# Altium schematic sheet SAM4S_Piezo_LED.SchDoc: Wacky Hat Schematic
size A3; DrawnBy: A. Finlayson, H. Pollard; Organization: Group 17; Address1: ECE Department; Address2: University of Canterbury; Address3: Christchurch 8041; Address4: New Zealand; Revision: 1; SheetNumber: 3; SheetTotal: 3
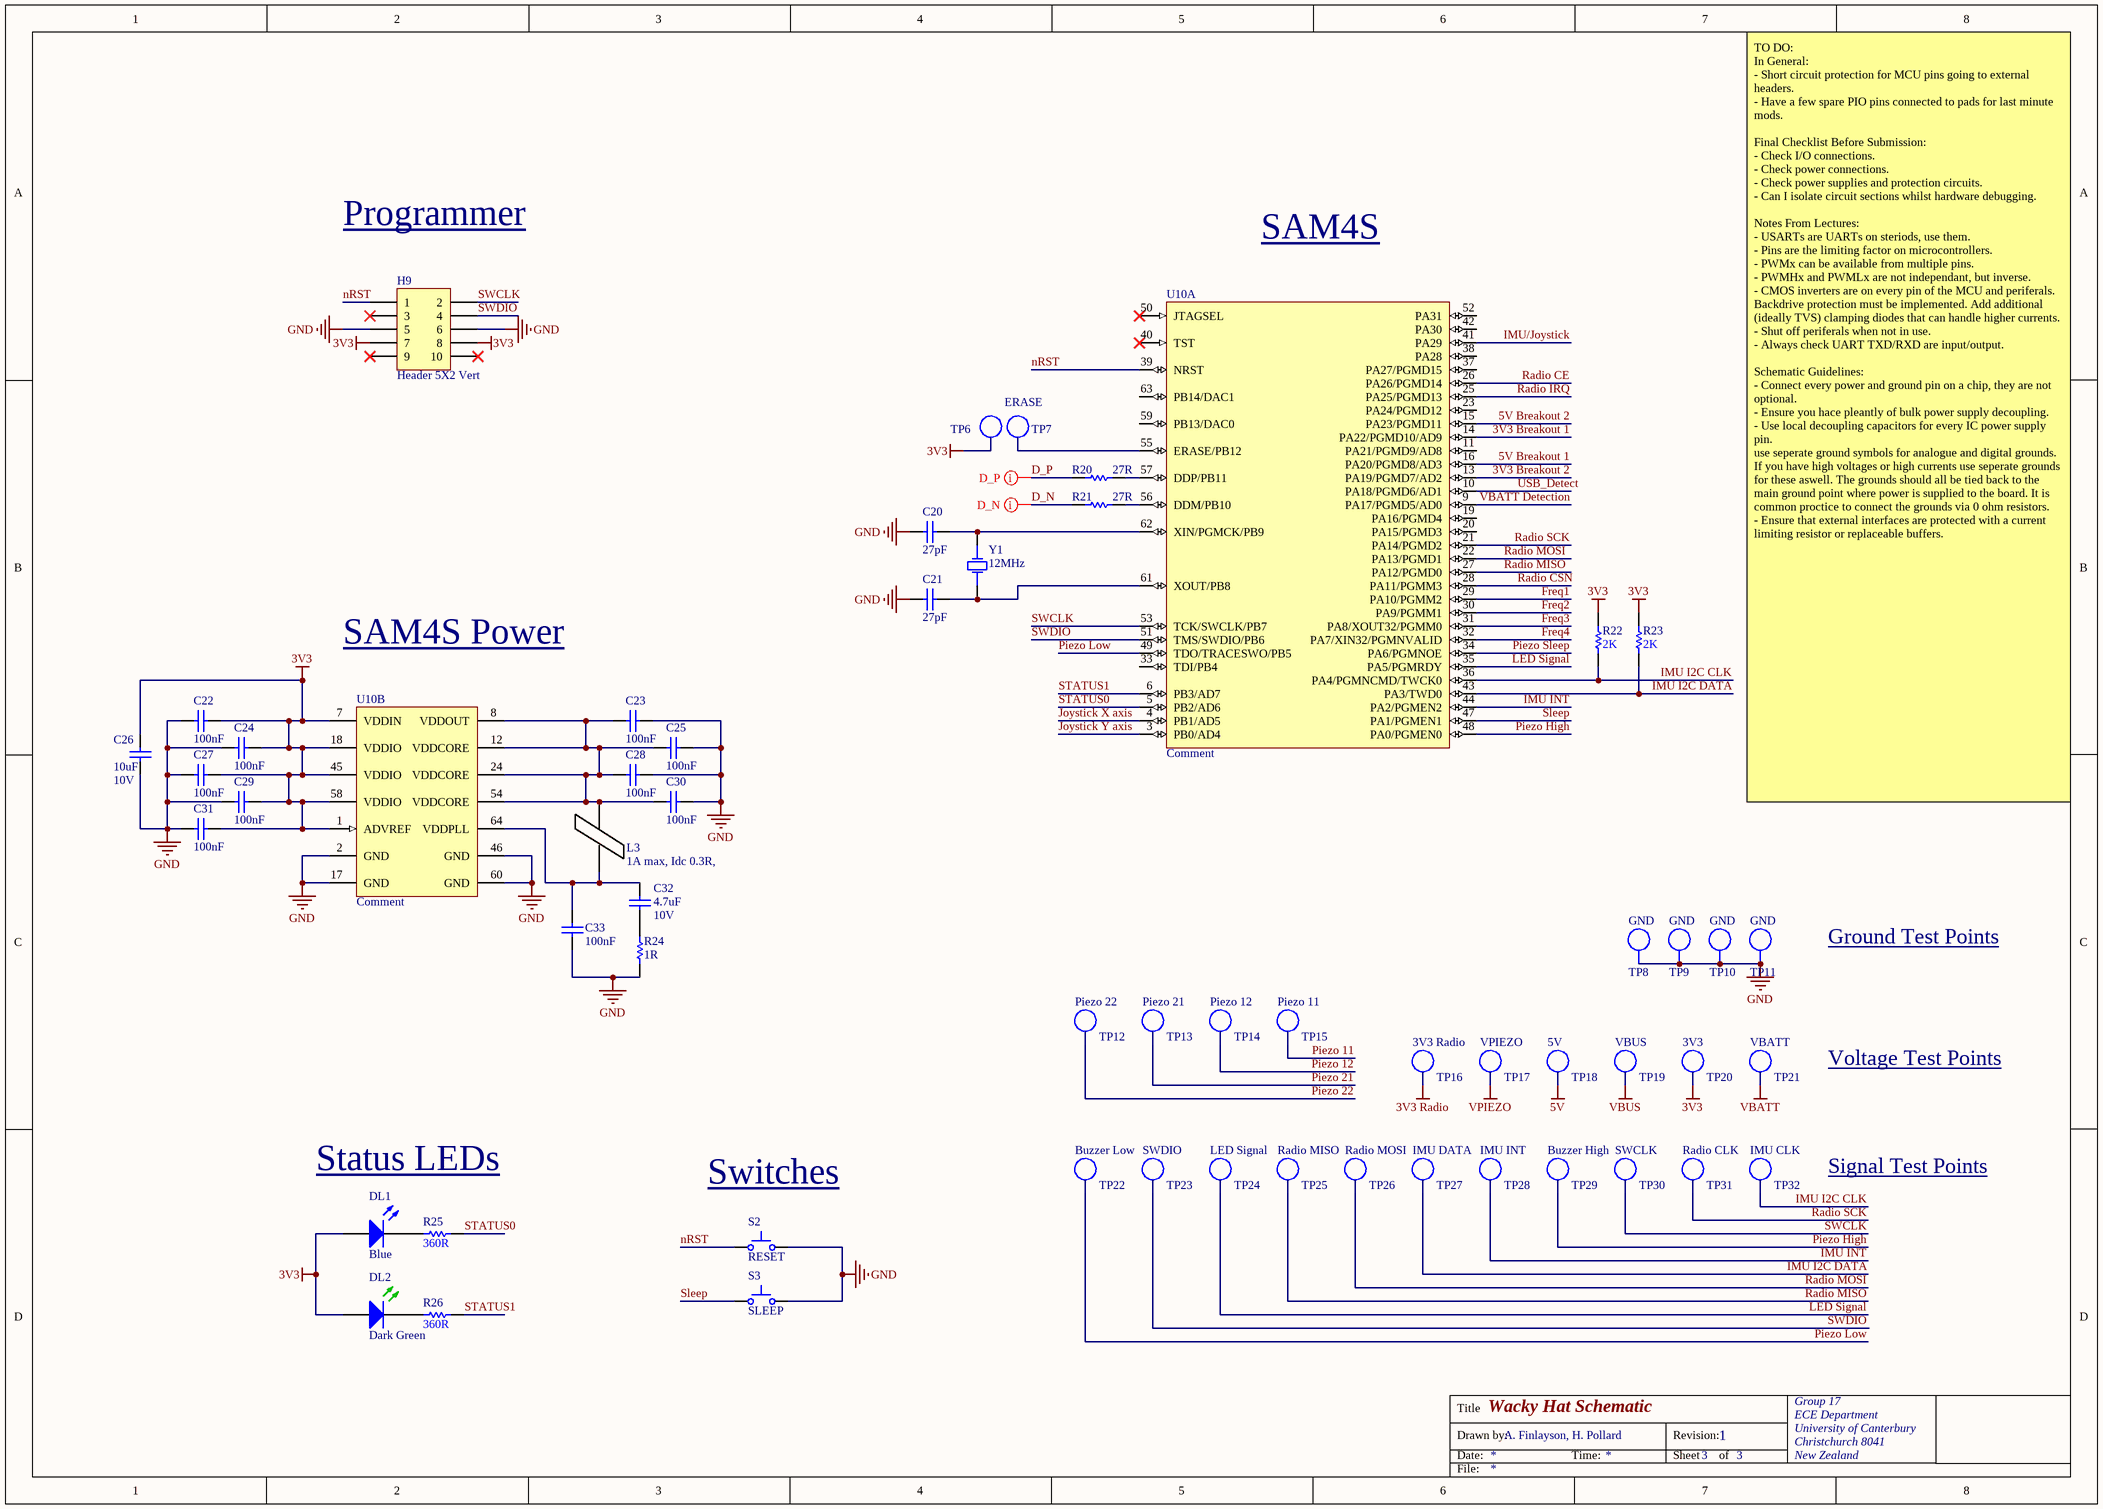
[diagram p0: SAM4S_Piezo_LED.SchDoc]

## Parts
C20  27pF  [CAPC1608L]
C21  27pF  [CAPC1608L]
C22  100nF  [CAPC1608L]
C23  100nF  [CAPC1608L]
C24  100nF  [CAPC1608L]
C25  100nF  [CAPC1608L]
C26  Max Voltage: 10V  [CAPC2012L]  (hidden comment: 10uF)
C27  100nF  [CAPC1608L]
C28  100nF  [CAPC1608L]
C29  100nF  [CAPC1608L]
C30  100nF  [CAPC1608L]
C31  100nF  [CAPC1608L]
C32  Max Voltage: 10V  [CAPC1608N]  (hidden comment: 4.7uF)
C33  100nF  [CAPC1608L]
DL1  Blue  [WL-SMCW0603]
DL2  Dark Green  [WL-SMCW0603]
H9  Header 5X2 Vert  [IDC2.54-V10D]
L3  1A max, Idc 0.3R,  [INDC3216L]
R20  27R  [RESC1608L]
R21  27R  [RESC1608L]
R22  2K  [RESC1608L]
R23  2K  [RESC1608L]
R24  1R  [RESC3216L]
R25  360R  [RESC1608L]
R26  360R  [RESC1608L]
S2  RESET  [EVQPNF05M]
S3  SLEEP  [EVQPNF05M]
TP6  TP_0603  [TP_0603]  (value not drawn)
TP7  ERASE  [TP_0603]
TP8  GND  [TP_1206]  (no BOM)
TP9  GND  [TP_1206]  (no BOM)
TP10  GND  [TP_1206]  (no BOM)
TP11  GND  [TP_1206]  (no BOM)
TP12  Piezo 22  [TP_0603]
TP13  Piezo 21  [TP_0603]
TP14  Piezo 12  [TP_0603]
TP15  Piezo 11  [TP_0603]
TP16  3V3 Radio  [TP_0603]
TP17  VPIEZO  [TP_0603]
TP18  5V  [TP_0603]
TP19  VBUS  [TP_0603]
TP20  3V3  [TP_0603]
TP21  VBATT  [TP_0603]
TP22  Buzzer Low  [TP_0603]
TP23  SWDIO  [TP_0603]
TP24  LED Signal  [TP_0603]
TP25  Radio MISO  [TP_0603]
TP26  Radio MOSI  [TP_0603]
TP27  IMU DATA  [TP_0603]
TP28  IMU INT  [TP_0603]
TP29  Buzzer High  [TP_0603]
TP30  SWCLK  [TP_0603]
TP31  Radio CLK  [TP_0603]
TP32  IMU CLK  [TP_0603]
U10  Comment  [LQFP64_L]  (parts A,B of 2)
Y1  12MHz  [6.0X3.5-4]

## Nets
3V3: C22.2 C24.2 C26.2 C27.2 C29.2 C31.2 DL1.2(A) DL2.2(A) H9.7 H9.8 R22.2 R23.2 TP6.1(TP) TP20.1(TP) U10.1(ADVREF) U10.7(VDDIN) U10.18(VDDIO) U10.45(VDDIO) U10.58(VDDIO)
3V3 Radio: TP16.1(TP)
5V: TP18.1(TP)
GND: C20.1 C21.1 C22.1 C23.2 C24.1 C25.2 C26.1 C27.1 C28.2 C29.1 C30.2 C31.1 C33.1 H9.5 H9.6 R24.1 S2.2 S3.2 TP8.1 TP9.1 TP10.1 TP11.1 U10.2(GND) U10.17(GND) U10.46(GND) U10.60(GND)
VBATT: TP21.1(TP)
VBUS: TP19.1(TP)
VPIEZO: TP17.1(TP)
3V3 Breakout 1: U10.14(PA22/PGMD10/AD9)
3V3 Breakout 2: U10.13(PA19/PGMD7/AD2)
5V Breakout 1: U10.16(PA20/PGMD8/AD3)
5V Breakout 2: U10.15(PA23/PGMD11)
D_N: R21.1
D_P: R20.1
Freq1: U10.29(PA10/PGMM2)
Freq2: U10.30(PA9/PGMM1)
Freq3: U10.31(PA8/XOUT32/PGMM0)
Freq4: U10.32(PA7/XIN32/PGMNVALID)
IMU I2C CLK: R22.1 TP32.1(TP) U10.36(PA4/PGMNCMD/TWCK0)
IMU I2C DATA: R23.1 TP27.1(TP) U10.43(PA3/TWD0)
IMU INT: TP28.1(TP) U10.44(PA2/PGMEN2)
IMU/Joystick: U10.41(PA29)
Joystick X axis: U10.4(PB1/AD5)
Joystick Y axis: U10.3(PB0/AD4)
LED Signal: TP24.1(TP) U10.35(PA5/PGMRDY)
nRST: H9.1 S2.1 U10.39(NRST)
Piezo 11: TP15.1(TP)
Piezo 12: TP14.1(TP)
Piezo 21: TP13.1(TP)
Piezo 22: TP12.1(TP)
Piezo High: TP29.1(TP) U10.48(PA0/PGMEN0)
Piezo Low: TP22.1(TP) U10.49(TDO/TRACESWO/PB5)
Piezo Sleep: U10.34(PA6/PGMNOE)
Radio CE: U10.26(PA26/PGMD14)
Radio CSN: U10.28(PA11/PGMM3)
Radio IRQ: U10.25(PA25/PGMD13)
Radio MISO: TP25.1(TP) U10.27(PA12/PGMD0)
Radio MOSI: TP26.1(TP) U10.22(PA13/PGMD1)
Radio SCK: TP31.1(TP) U10.21(PA14/PGMD2)
Sleep: S3.1 U10.47(PA1/PGMEN1)
STATUS0: R25.2 U10.5(PB2/AD6)
STATUS1: R26.2 U10.6(PB3/AD7)
SWCLK: H9.2 TP30.1(TP) U10.53(TCK/SWCLK/PB7)
SWDIO: H9.4 TP23.1(TP) U10.51(TMS/SWDIO/PB6)
USB_Detect: U10.10(PA18/PGMD6/AD1)
VBATT Detection: U10.9(PA17/PGMD5/AD0)
NetC20_2: C20.2 U10.62(XIN/PGMCK/PB9) Y1.3(OSC2)
NetC21_2: C21.2 U10.61(XOUT/PB8) Y1.1(OSC1)
NetC23_1: C23.1 C25.1 C28.1 C30.1 L3.2 U10.8(VDDOUT) U10.12(VDDCORE) U10.24(VDDCORE) U10.54(VDDCORE)
NetC32_1: C32.1 R24.2
NetC32_2: C32.2 C33.2 L3.1 U10.64(VDDPLL)
NetDL1_1: DL1.1(K) R25.1
NetDL2_1: DL2.1(K) R26.1
NetR20_2: R20.2 U10.57(DDP/PB11)
NetR21_2: R21.2 U10.56(DDM/PB10)
NetTP7_1: TP7.1(TP) U10.55(ERASE/PB12)

Not connected (* = marked no-connect by the designer): H9 3* 9* 10*; U10 11(PA21/PGMD9/AD8) 19(PA16/PGMD4) 20(PA15/PGMD3) 23(PA24/PGMD12) 33(TDI/PB4) 37(PA27/PGMD15) 38(PA28) 40(TST)* 42(PA30) 50(JTAGSEL)* 52(PA31) 59(PB13/DAC0) 63(PB14/DAC1)

## Layout directives
differential pair: D_N, D_P

## Notes on the sheet
- Programmer
- SAM4S
- SAM4S Power
- TO DO:
  In General:
  - Short circuit protection for MCU pins going to external headers.
  - Have a few spare PIO pins connected to pads for last minute mods.
  Final Checklist Before Submission:
  - Check I/O connections.
  - Check power connections.
  - Check power supplies and protection circuits.
  - Can I isolate circuit sections whilst hardware debugging.
  Notes From Lectures:
  - USARTs are UARTs on steriods, use them.
  - Pins are the limiting factor on microcontrollers.
  - PWMx can be available from multiple pins.
  - PWMHx and PWMLx are not independant, but inverse.
  - CMOS inverters are on every pin of the MCU and periferals. Backdrive protection must be implemented. Add additional (ideally TVS) clamping diodes that can handle higher currents.
  - Shut off periferals when not in use.
  - Always check UART TXD/RXD are input/output.
  Schematic Guidelines:
  - Connect every power and ground pin on a chip, they are not optional.
  - Ensure you hace pleantly of bulk power supply decoupling.
  - Use local decoupling capacitors for every IC power supply pin.
  use seperate ground symbols for analogue and digital grounds. If you have high voltages or high currents use seperate grounds for these aswell. The grounds should all be tied back to the main ground point where power is supplied to the board. It is common proctice to connect the grounds via 0 ohm resistors.
  - Ensure that external interfaces are protected with a current limiting resistor or replaceable buffers.
- Ground Test Points
- Voltage Test Points
- Status LEDs
- Switches
- Signal Test Points
- Title
- Drawn by:
- Date:
- Time:
- Revision:
- Sheet
- of
- File:

## Library data of the parts
C20 C21 = CC_27pF_0603: CAP CER 27pF NPO/COG +-5% 50V 0603; PackageReference: 0603; Code_IPC: 1608 [0603]; Verify: *; Supplier: ECE Dept; Storage Location: PCB Assembly WS; Value: 27pF
C22-C25 C27-C31 C33 = CC_100nF_0603: CAP CER 100nF X7R +-10% 50V 0603; PackageReference: 0603; Code_IPC: 1608 [0603]; Verify: *; Supplier: ECE Dept; Storage Location: PCB Assembly WS; Value: 100nF
C26 = CC_10uF_0805_10V: CAP CER 10uF X7R +-20% 10V 0805; Note: Footprint corresponds to dimensions for bulk cassette packaging. This case size has tightened tolerances.; PackageReference: 0805; Code_IPC: 2012[0805]; Verify: *; Supplier: ECE Dept; Storage Location: PCB Assembly WS; Value: 10uF
C32 = CC_4.7uF_0603: CAP CER 4.7uF X5R +-20%  10V 0603; Note: Footprint corresponds to dimensions for bulk cassette packaging. This case size has tightened tolerances.; PackageReference: 0805; Code_IPC: 2012[0805]; Verify: *; Supplier: ECE Dept; Storage Location: PCB Assembly WS; Value: 4.7uF
DL1 = DL_150060BS75000: LED Blue 270mcd 0603 SMD; Manufacturer: WURTH ELEKTRONIK; Forward Current If: 30; Forward Voltage: 3.2; Luminous Intensity: 270; Viewing Angle: 120°; Wavelength Typ: 470; Pricing: 1=0.3844, 50=0.3252, 100=0.2957, 500=0.2365 (NZD); Supplier 1: Farnell; Supplier Part Number 1: 2322069; Manufacturer Part Number: 150060BS75000; Storage Location: PCB Assembly WS; Supplier: ECE Dept; LED Colour: Blue
DL2 = DL_150060GS75000: LED Dk Green 430mcd 0603 SMD; Manufacturer: WURTH ELEKTRONIK; Forward Current If: 30; Wavelength Typ: 520; Forward Voltage: 3.2; Lens Shape: Rectangular; Luminous Intensity: 430; Viewing Angle: 140°; LED Mounting: SMD; Supplier 1: Farnell; Supplier Part Number 1: 2322070; Manufacturer Part Number: 150060GS75000; Storage Location: PCB Assembly WS; Supplier: ECE Dept; LED Colour: Dark Green
H9 = JA_HDR_IDC_5X2_VERT: IDC Header, 2,54mm, 10-Pin, Vert; Supplier: ECE Dept; Supplier 1: Farnell; Supplier Part Number 1: 1096985; Storage Location: ECE Dept Store
L3 = IN_Ferrite-Bead: Ferrite Bead, Rdc 0.3R, Z100MHZ 600R, Imax 1A, SMD 1206; Manufacturer: FAIR-RITE; Manufacturer PN: 2512066017Y1; DC Current Rating: 1; DC Resistance Max: 0.08; Ferrite Case Style: 1206 ^3216 Metric]; Frequency Range: 50MHz to 1; Impedance: 600; Impedance Tolerance: ± 25%; Supplier: ECE Dept; Storage Location: PCB Assembly WS; Ferrite Mounting: SMD; Supplier 1: Farnell; Supplier Part Number 1: 1612060; Manufacturer Part Number: 2512066017Y1; Value: 1A max, Idc 0.3R,
R20 R21 = RS_27R: RES 27 OHM 1/10W 5% 0603 SMD; Storage Location: PCB Assembly WS; Supplier: ECE Dept; Value: 27R
R22 R23 = RS_2K: RES 2K OHM 1/10W 5% 0603 SMD; Storage Location: PCB Assembly WS; Supplier: ECE Dept; Value: 2K
R24 = RT_1R: RES 1R OHM 1/4W 5% 1206 SMD; Storage Location: PCB Assembly WS; Supplier: ECE Dept; Value: 1R
R25 R26 = RS_360R: RES 360 OHM 1/10W 5% 0603 SMD; Storage Location: PCB Assembly WS; Supplier: ECE Dept; Value: 360R
S2 S3 = WS_EVQPNF05M: Panasonic 6 x 3.5mm SMD Light Touch Switch Type SMD; PackageDescription: 6.0 x 3.5 mm; Supplier 1: Farnell; Supplier Part Number 1: 2079481; Manufacturer: Panasonic; Manufacturer PN: EVQPNF05M; Supplier 2: Digi-Key; Supplier Part Number 2: P13598SCT-ND; Storage Location: PCB Assembly WS; Supplier: ECE Dept
TP6 TP7 TP12-TP32 = TP_0603: Test Point 1.65X0.9X1.2mm SMD; Manufacturer: TE Connectivity AMP Connectors; Manufacturer Part Number: 1625854-3; Mounting Type: Surface Mount; Type: PC Test Point; Supplier 1: Digi-Key; Supplier Part Number 1: A106145CT-ND; Terminal: 0.063" x 0.031" x 0.045" (1.60mm x 0.80mm x 1.15mm)
TP8-TP11 = TP_1206: Test-Point 3.3x1.6x2.1mm SMD; Manufacturer: Harwin Inc; Manufacturer Part Number: S1751-46R; Value: TP; Manufacturer PN: *; Storage Location: ProtoPlace; Mounting Type: Surface Mount; Type: PC Test Point; Supplier 1: Digi-Key; Supplier Part Number 1: 952-1478-2-ND; Supplier 2: Farnell; Supplier Part Number 2: 1826282; Supplier: ECE Dept
U10 = SE_ATSAM4S16BA-MU: IC MCU 32BIT 512KB FLASH 64LQFP; Manufacturer: Atmel; Manufacturer Part Number: ATSAM4S8BA-ANR; Connectivity: I²C, IrDA, Memory Card, SPI, SSC, UART/USART, USB; Core Processor: ARM® Cortex®-M4; Core Size: 32-Bit; Data Converters: A/D 11x12b, D/A 2x12b; Number of I/O: 47; Peripherals: Brown-out Detect/Reset, DMA, POR, PWM, WDT; Program Memory Size: 512KB (512K x 8); RAM Size: 128K x 8; Speed: 120MHz; Voltage - Supply (Vcc/Vdd): 1.62 V ~ 3.6 V; PackageVersion: revJ, Jul-2007; PackageReference: 64PS; PackageDescription: 64-Pin Quad Flat No-Lead (QFN) Sawn, 9 x 9 x 1.0 mm Body, 0.5 mm Pitch, Exposed Pad; Code_JEDEC: MO-220VMMD-3; ComponentLink1Description: Manufacturer URL; ComponentLink1URL: http://www.atmel.com/; ComponentLink2Description: SAM4S Series Datasheet; ComponentLink2URL: http://www.atmel.com/dyn/resources/prod_documents/11100.pdf; ComponentLink3Description: SAM4S Series Summary; ComponentLink3URL: http://www.atmel.com/dyn/resources/prod_documents/11100S.pdf; Supplier 1: Digi-Key; Package / Case: 64-LQFP; Packaging: Cut Tape (CT); Program Memory Type: FLASH; Supplier Part Number 1: ATSAM4S8BA-ANRCT-ND
Y1 = XT_CRYSTAL_12MHz_18pF: CRYSTAL 12MHZ 18PF 6X3.5mm SMD; Manufacturer: CTS-Frequency Controls; Manufacturer Part Number: 406C35D12M00000; ESR (Equivalent Series Resistance): 60 Ohm; Frequency Stability: ±50ppm; Frequency Tolerance: ±30ppm; Operating Mode: Fundamental; Supplier 1: Digi-Key; Height: 0.047" (1.20mm); Load Capacitance: 18pF; Mounting Type: Surface Mount; Operating Temperature: -20°C ~ 70°C; Package / Case: 4-SMD, No Lead (DFN, LCC); Size / Dimension: 0.236" L x 0.138" W (6.00mm x 3.50mm); Supplier Part Number 1: CTX855CT-ND; Frequency: 12MHz